# EAGLE design cotroler (EAGLE 9.5.2)
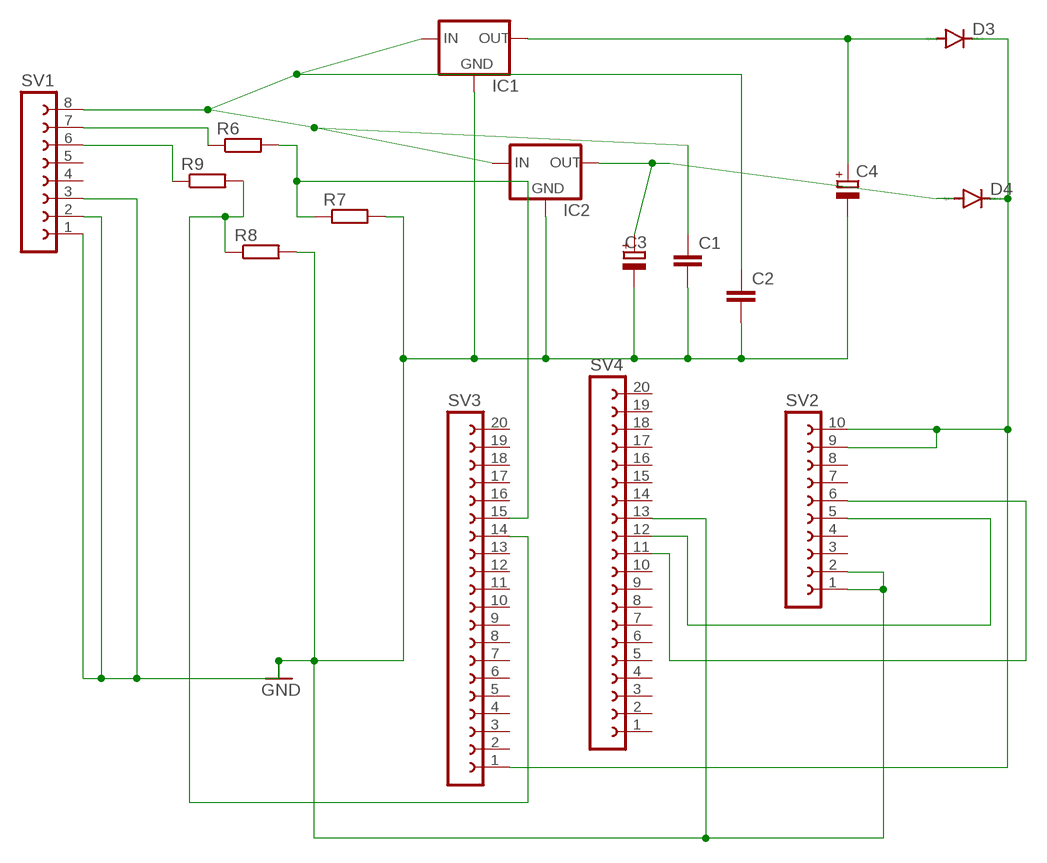
[diagram p0: schematic, sheet 1]

## Parts
C1  C-EU025-024X044  [C025-024X044]
C2  C-EU025-024X044  [C025-024X044]
C3  CPOL-EUE2.5-5  [E2,5-5]
C4  CPOL-EUE2.5-5  [E2,5-5]
D3  DIODE-D-10  [D-10]
D4  DIODE-D-10  [D-10]
IC1  78XXS  [78XXS]
IC2  78XXS  [78XXS]
R6  R-EU_0207/10  [0207/10]
R7  R-EU_0207/10  [0207/10]
R8  R-EU_0207/10  [0207/10]
R9  R-EU_0207/10  [0207/10]
SV1  FE08-1  [FE08]
SV2  FE10-1  [FE10]
SV3  FE20-1  [FE20]
SV4  FE20-1  [FE20]

## Nets
GND: C1.2 C2.2 C3.- C4.- IC1.GND IC2.GND R7.2 R8.2 SV1.1 SV1.2 SV1.3 SV2.1 SV2.2 SV4.13
N$1: R6.1 SV1.7
N$2: SV2.5 SV4.12
N$3: C1.1 C2.1 IC1.IN IC2.IN SV1.8
N$4: R6.2 R7.1 SV3.15
N$5: R9.1 SV1.6
N$6: R8.1 R9.2 SV3.14
N$7: C3.+ D4.A IC2.OUT
N$8: C4.+ D3.A IC1.OUT
N$9: SV2.6 SV4.11
N$10: D3.C D4.C SV2.9 SV2.10 SV3.1
Unconnected: SV1.4 SV1.5 SV2.3 SV2.4 SV2.7 SV2.8 SV3.2 SV3.3 SV3.4 SV3.5 SV3.6 SV3.7 SV3.8 SV3.9 SV3.10 SV3.11 SV3.12 SV3.13 SV3.16 SV3.17 SV3.18 SV3.19 SV3.20 SV4.1 SV4.2 SV4.3 SV4.4 SV4.5 SV4.6 SV4.7 SV4.8 SV4.9 SV4.10 SV4.14 SV4.15 SV4.16 SV4.17 SV4.18 SV4.19 SV4.20

## Library data of the parts
C1 C2 = rcl:C-EU: CAPACITOR, European symbol; SPICEPREFIX: C
C3 C4 = rcl:CPOL-EU: POLARIZED CAPACITOR, European symbol; SPICEPREFIX: C
D3 D4 = diode:DIODE-: DIODE
IC1 IC2 = v-reg:78XXS: VOLTAGE REGULATOR
R6-R9 = resistor:R-EU_: RESISTOR, European symbol
SV1 = con-lsta:FE08-1: FEMALE HEADER; OC_FARNELL: unknown; OC_NEWARK: unknown
SV2 = con-lsta:FE10-1: FEMALE HEADER; OC_FARNELL: unknown; OC_NEWARK: unknown
SV3 SV4 = con-lsta:FE20-1: FEMALE HEADER; OC_FARNELL: unknown; OC_NEWARK: unknown

## Board
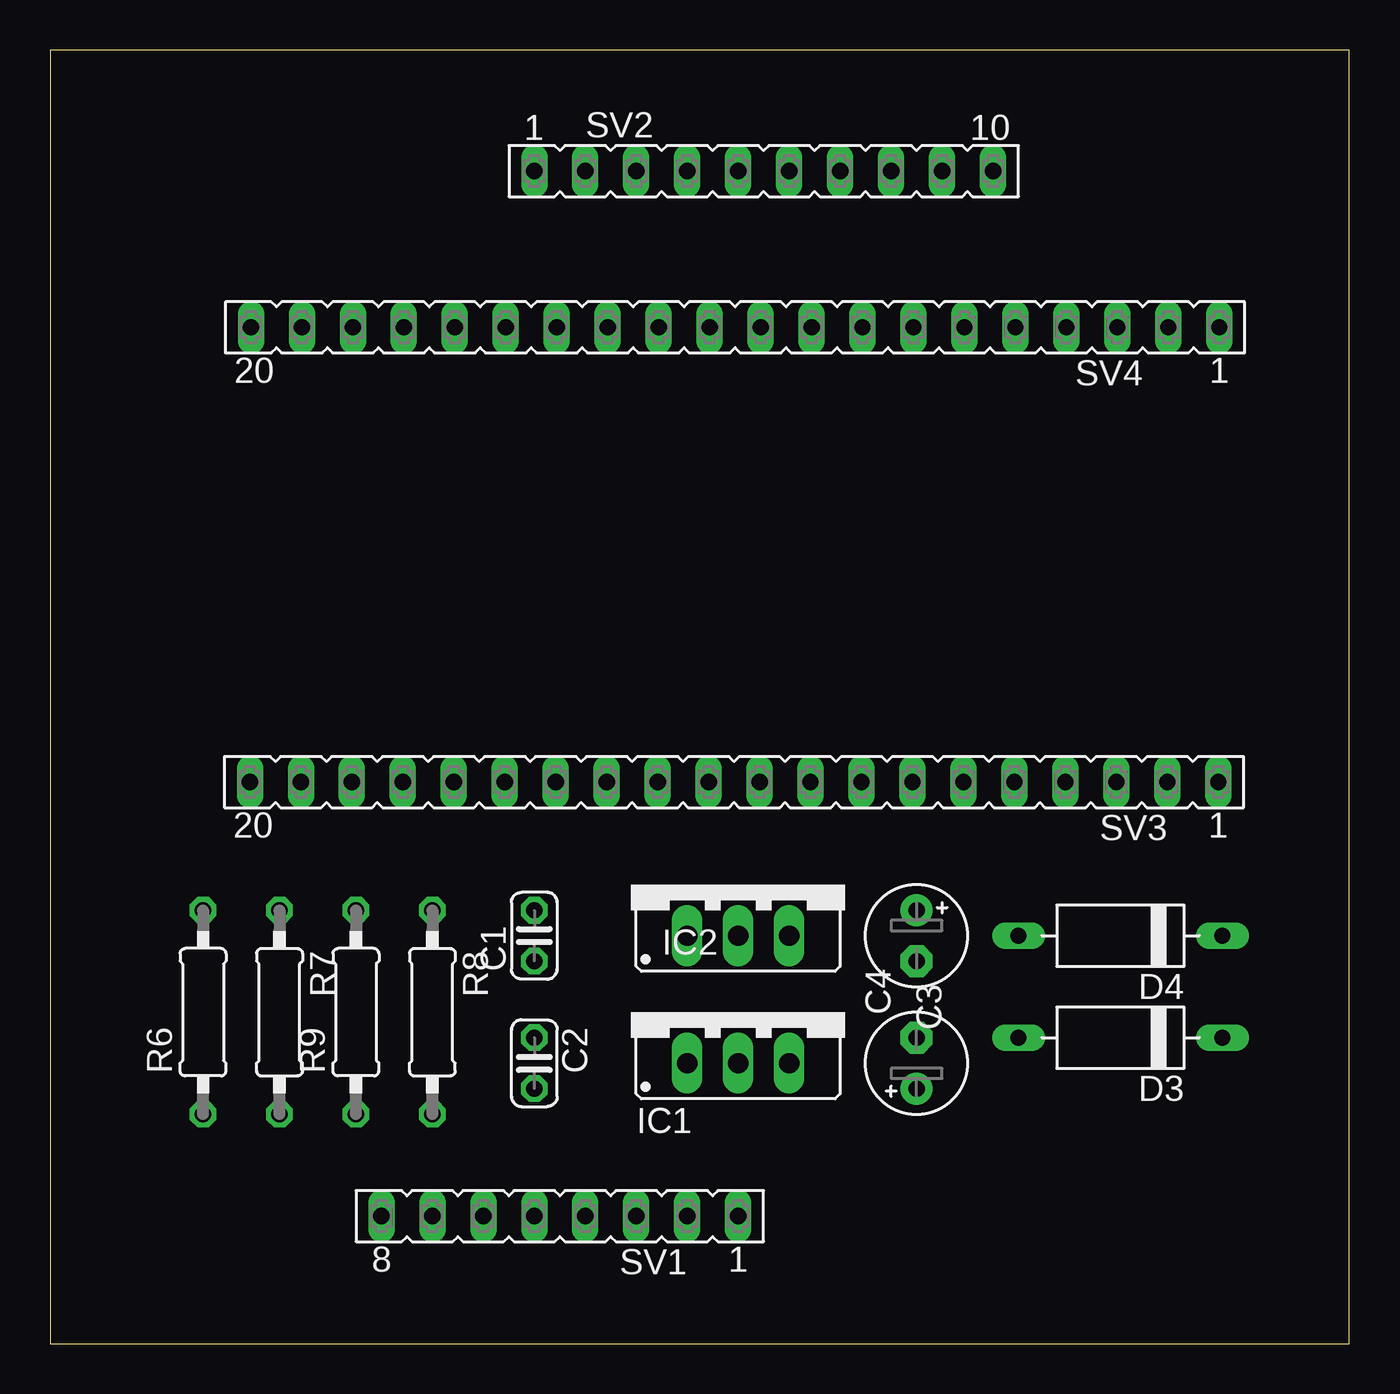
[diagram p1: board, top side]
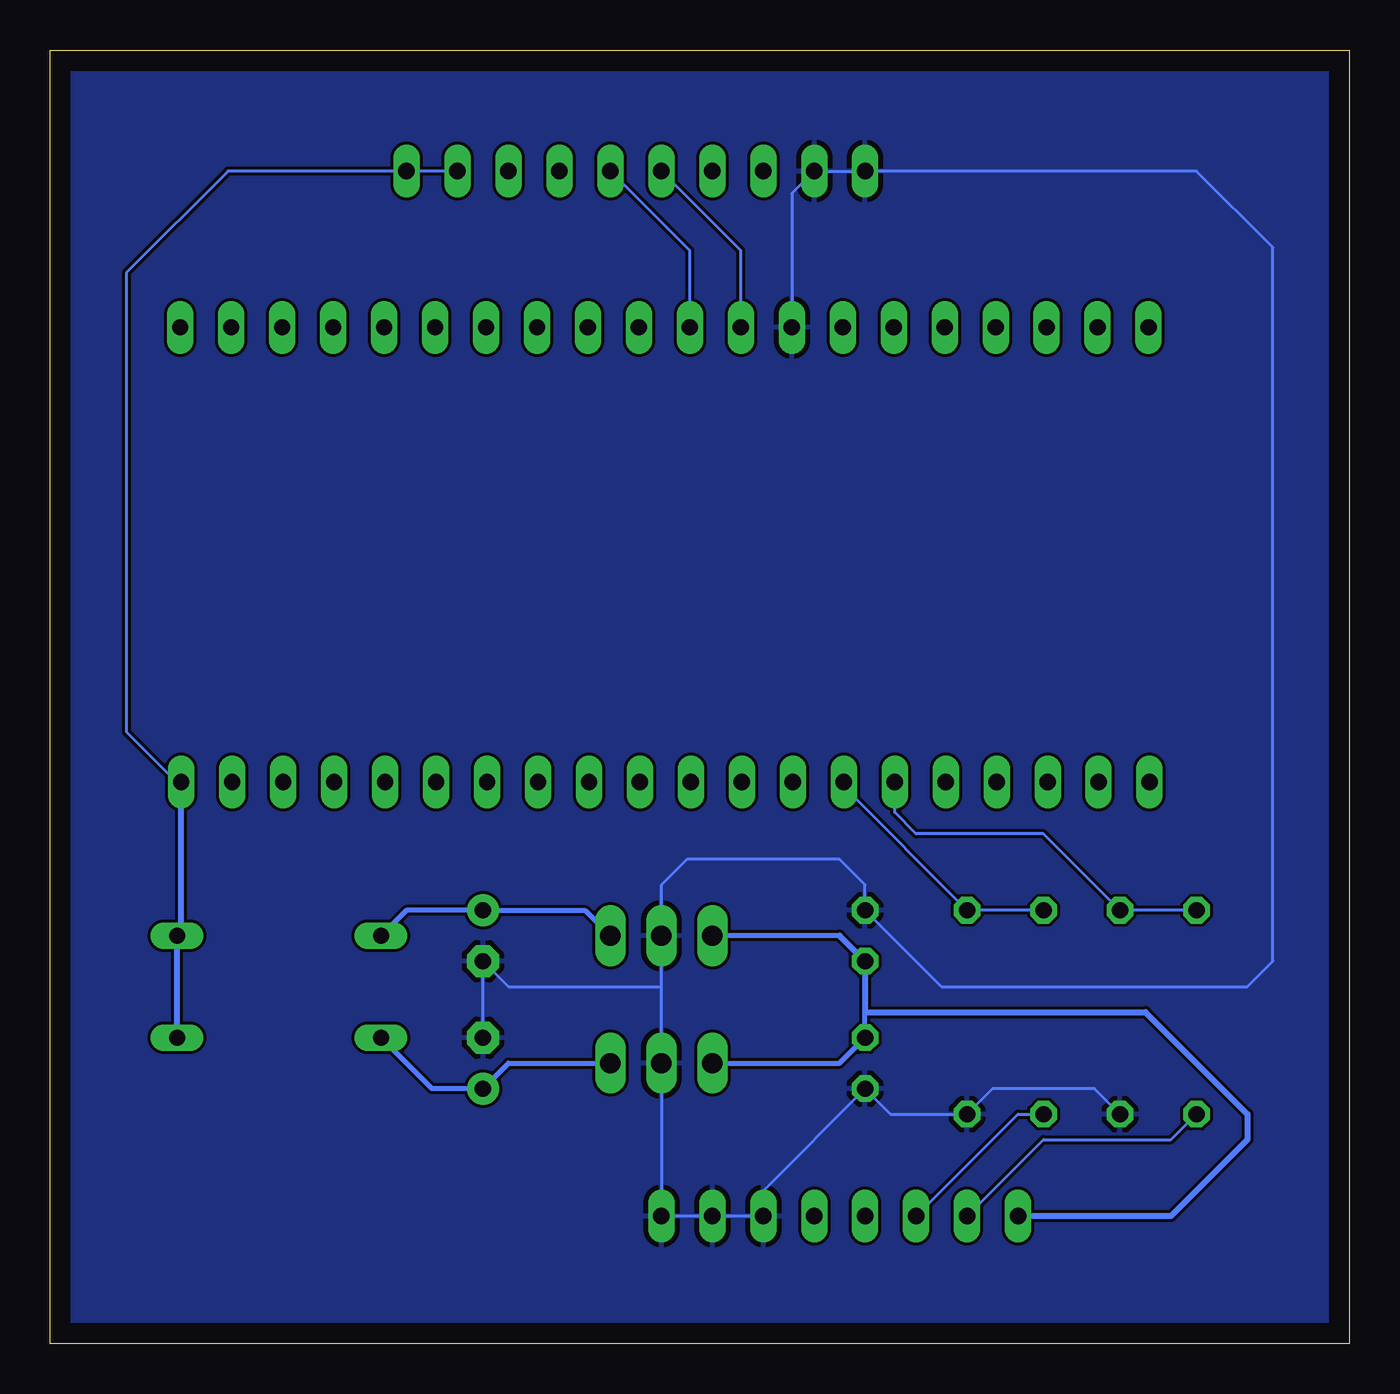
[diagram p2: board, bottom side, seen from below]

Size 64.75 x 64.44 mm. Coordinates in mm from the lower left corner, seen from the top.
Outline: 0,0 64.75,0 64.75,64.44 0,64.44 0,0
Copper layers (1*16): Top 0.035mm / dielectric 1.5mm / Bottom 0.035mm
Design rules "default": minimum track width 6mil, minimum drill 0.35mm, track to track 6mil, track to pad 6mil, pad to pad 6mil, via to via 6mil, smd to smd 6mil, copper to edge 40mil, drill to drill 6mil, minimum pad ring 10mil, minimum via ring 8mil, stop-mask expansion 4mil, vias tented up to drill 0mil, thermal gap 10mil

### Footprints (pad centres in the part's own frame; a part is rotated, then mirrored left to right if it is on the bottom)
C025-024X044 = drill 0.813 octagon: 1 -1.27,0; 2 1.27,0
E2,5-5 = drill 0.813 pad 1.6: + -1.27,0 | drill 0.813 pad 1.6 octagon: - 1.27,0
D-10 = drill 0.813 long: A 5.08,0; C -5.08,0
78XXS = drill 1.016 long: GND 0,-2.54; IN -2.54,-2.54; OUT 2.54,-2.54
0207/10 = drill 0.813 octagon: 1 -5.08,0; 2 5.08,0
FE08 = drill 0.813 long: 1 -8.89,0; 2 -6.35,0; 3 -3.81,0; 4 -1.27,0; 5 1.27,0; 6 3.81,0; 7 6.35,0; 8 8.89,0
FE10 = drill 0.813 long: 1 -11.43,0; 2 -8.89,0; 3 -6.35,0; 4 -3.81,0; 5 -1.27,0; 6 1.27,0; 7 3.81,0; 8 6.35,0; 9 8.89,0; 10 11.43,0
FE20 = drill 0.813 long: 1 -24.13,0; 2 -21.59,0; 3 -19.05,0; 4 -16.51,0; 5 -13.97,0; 6 -11.43,0; 7 -8.89,0; 8 -6.35,0; 9 -3.81,0; 10 -1.27,0; 11 1.27,0; 12 3.81,0; 13 6.35,0; 14 8.89,0; 15 11.43,0; 16 13.97,0; 17 16.51,0; 18 19.05,0; 19 21.59,0; 20 24.13,0

### Placement (x,y rotation side)
C1  24.13,20.32 90 top
C2  24.13,13.97 270 top
C3  43.18,20.32 270 top
C4  43.18,13.97 90 top
D3  53.34,15.24 180 top
D4  53.34,20.32 180 top
IC1  34.29,16.51 0 top
IC2  34.29,22.86 0 top
R6  7.62,16.51 90 top
R7  11.43,16.51 270 top
R8  19.05,16.51 270 top
R9  15.24,16.51 90 top
SV1  25.4,6.35 180 top
SV2  35.56,58.42 0 top
SV3  34.09,27.98 180 top
SV4  34.14,50.63 180 top

### Tracks (layer width: path | path; a pad name or v marks a point on that pad's centre or on a via)
GND
  Bottom 0.152: C4.- C3.- 41.91,17.78 34.29,17.78 | 34.29,17.78 IC1.GND SV1.1 SV1.2 SV1.3 29.21,7.62 C2.2 22.86,11.43 R8.2 17.78,12.7 12.7,12.7 R7.2 | 34.29,17.78 IC2.GND 34.29,22.86 33.02,24.13 25.4,24.13 24.13,22.86 C1.2 20.32,17.78 5.08,17.78 3.81,19.05 3.81,54.61 7.62,58.42 SV2.1 SV2.2 27.79,57.3 SV4.13
  pour Bottom: 0,64.77 0,0 64.77,0 64.77,64.77
  pour Bottom: 1.27,63.5 1.27,0 64.77,0 64.77,63.5
N$1
  Bottom 0.152: SV1.7 15.24,10.16 8.89,10.16 R6.1
N$2
  Bottom 0.152: SV4.12 30.33,54.46 SV2.5
N$3
  Bottom 0.254: 25.4,20.32 IC2.IN | IC1.IN 25.4,13.97 C2.1 24.13,16.51
  Bottom 0.305: 25.4,20.32 C1.1 24.13,16.51 10.16,16.51 5.08,11.43 5.08,10.16 8.89,6.35 SV1.8
N$4
  Bottom 0.152: SV3.15 22.66,26.47 21.59,25.4 15.24,25.4 R7.1 R6.2
N$5
  Bottom 0.152: SV1.6 16.51,11.43 R9.1
N$6
  Bottom 0.152: SV3.14 25.2,27.74 R8.1 R9.2
N$7
  Bottom 0.254: D4.A 46.99,21.59 C3.+ 38.1,21.59 IC2.OUT
N$8
  Bottom 0.254: IC1.OUT 41.91,13.97 C4.+ 45.72,12.7 D3.A
N$9
  Bottom 0.152: SV4.11 32.87,54.46 SV2.6
N$10
  Bottom 0.152: SV3.1 58.22,27.94 58.42,27.94 60.96,30.48 60.96,53.34 55.88,58.42 SV2.10 SV2.9
  Bottom 0.305: D3.C D4.C 58.22,20.52 58.22,27.94